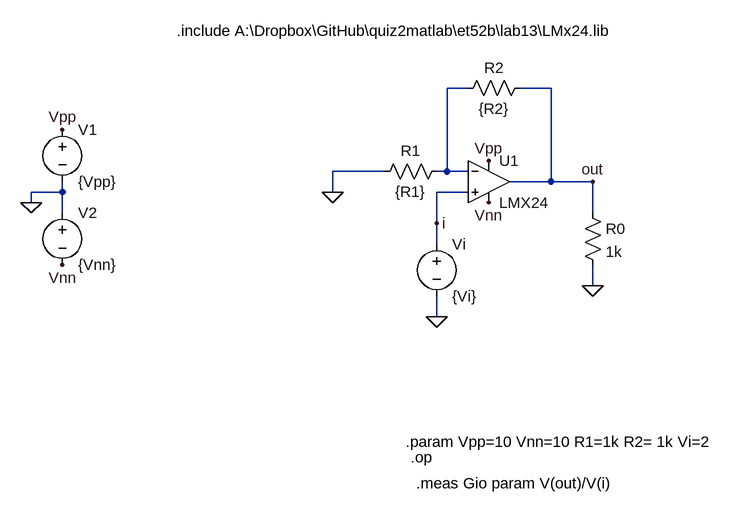
[diagram p0: schematic lab13b.asc]
lab13b.asc, the LTspice schematic file:
Version 4
SHEET 1 988 680
WIRE -16 32 -48 32
WIRE 112 32 64 32
WIRE -144 160 -224 160
WIRE -48 160 -48 32
WIRE -48 160 -64 160
WIRE -16 160 -48 160
WIRE 112 176 112 32
WIRE 112 176 48 176
WIRE 176 176 112 176
WIRE -640 192 -640 176
WIRE -640 192 -688 192
WIRE -224 192 -224 160
WIRE -16 192 -64 192
WIRE -688 208 -688 192
WIRE -640 224 -640 192
WIRE 176 224 176 176
WIRE -64 240 -64 192
WIRE -64 272 -64 240
WIRE 176 336 176 304
WIRE -64 384 -64 352
FLAG 16 144 Vpp
FLAG 16 208 Vnn
FLAG -688 208 0
FLAG -640 96 Vpp
FLAG -640 304 Vnn
FLAG -64 384 0
FLAG 176 176 out
FLAG 176 336 0
FLAG -64 240 i
FLAG -224 192 0
SYMBOL Opamps\\opamp2 16 112 R0
SYMATTR InstName U1
SYMATTR Value LMX24
SYMBOL voltage -640 80 R0
SYMATTR InstName V1
SYMATTR Value {Vpp}
SYMBOL voltage -640 208 R0
SYMATTR InstName V2
SYMATTR Value {Vnn}
SYMBOL voltage -64 256 R0
SYMATTR InstName Vi
SYMATTR Value {Vi}
SYMBOL res 160 208 R0
SYMATTR InstName R0
SYMATTR Value 1k
SYMBOL res -48 144 R90
WINDOW 0 0 56 VBottom 2
WINDOW 3 32 56 VTop 2
SYMATTR InstName R1
SYMATTR Value {R1}
SYMBOL res 80 16 R90
WINDOW 0 0 56 VBottom 2
WINDOW 3 32 56 VTop 2
SYMATTR InstName R2
SYMATTR Value {R2}
TEXT -464 -56 Left 2 !.include A:\\Dropbox\\GitHub\\quiz2matlab\\et52b\\lab13\\LMx24.lib
TEXT -112 576 Left 2 !.param Vpp=10 Vnn=10 R1=1k R2= 1k Vi=2
TEXT -104 600 Left 2 !.op
TEXT -96 640 Left 2 !.meas Gio param V(out)/V(i)

The netlist it stands for:
* lab13b.asc
XU1 i N001 Vpp Vnn out LMX24  ; pins In+ In- V+ V- OUT
V1 Vpp 0 {Vpp}
V2 0 Vnn {Vnn}
Vi i 0 {Vi}
R0 out 0 1k
R1 N001 0 {R1}
R2 out N001 {R2}
.include A:\Dropbox\GitHub\quiz2matlab\et52b\lab13\LMx24.lib
.param Vpp=10 Vnn=10 R1=1k R2= 1k Vi=2
.op
.meas Gio param V(out)/V(i)
.backanno
.end